# EAGLE schematic Sensor_Current_ INA21X_INA199AX (EAGLE 6.4)
Bidirectional Current Sensor (shunt resistor) INA199A1 Current Shunt Monitor <http://www.ti.com/lit/ds/symlink/ina199a1.pdf> INA213 Current Shunt Monitor <http://www.ti.com/lit/ds/symlink/ina211.pdf> Works with INA21X and INA199AX family current shunt monitors. Default senses up to +- 33A for a 3.3V ADC. It is recommended that ref be buffered or differentially compared to CS_OUT. It is not in this schematic and may be a source of error V+ pin could optionally be connected to battery voltage instead of +3V3 Connect CS_OUT to the microcontroller's ADC pin Connect CS_+ to the nominally higher voltage current sense line Connect CS_- to the nominally lower voltage current sense line
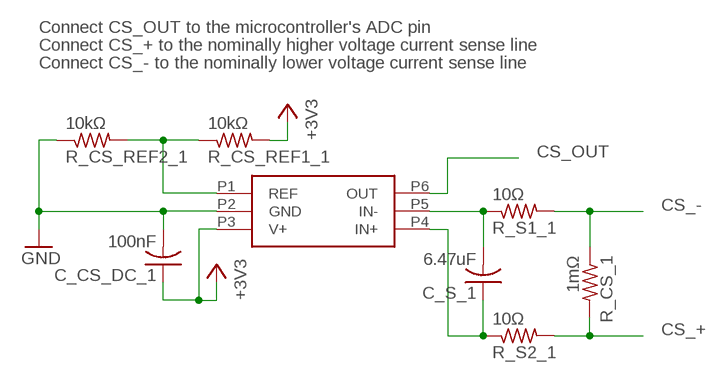
[diagram p0: schematic, sheet 1]

## Parts
C_CS_DC_1  100nF  C-USC0603  [C0603]
C_S_1  6.47uF  C-USC0603  [C0603]
CS_1  INA21X  [SC70]
R_CS_1  1mΩ  R-US_R1206  [R1206]
R_CS_REF1_1  10kΩ  R-US_R0603  [R0603]
R_CS_REF2_1  10kΩ  R-US_R0603  [R0603]
R_S1_1  10Ω  R-US_R0603  [R0603]
R_S2_1  10Ω  R-US_R0603  [R0603]

## Nets
+3V3: C_CS_DC_1.1 CS_1.P3(V+) R_CS_REF1_1.2
CS_+_1: R_CS_1.2 R_S2_1.2
CS_-_1: R_CS_1.1 R_S1_1.2
CS_OUT_1: CS_1.P6(OUT)
GND: C_CS_DC_1.2 CS_1.P2(GND) R_CS_REF2_1.1
IN+_1: C_S_1.1 CS_1.P4(IN+) R_S2_1.1
IN-_1: C_S_1.2 CS_1.P5(IN-) R_S1_1.1
V_REF_CS_1: CS_1.P1(REF) R_CS_REF1_1.1 R_CS_REF2_1.2

## Notes on the sheet
- Connect CS_OUT to the microcontroller's ADC pin
- Connect CS_+ to the nominally higher voltage current sense line
- Connect CS_- to the nominally lower voltage current sense line
- CS_OUT
- CS_-
- CS_+

## Library data of the parts
C_CS_DC_1 C_S_1 = resistor:C-US: CAPACITOR, American symbol
CS_1 = piccoli:INA21X
R_CS_1 R_CS_REF1_1 R_CS_REF2_1 R_S1_1 R_S2_1 = resistor:R-US_: RESISTOR, American symbol

## Net classes
4 xxwide: width 0.203 mm